# Altium schematic sheet Alimentation_USB_Header.SchDoc
size Tabloid; DocumentNumber: 3; SheetNumber: 3; SheetTotal: 7; Sheet_Name: Schéma_Bloc; Size: 11x17
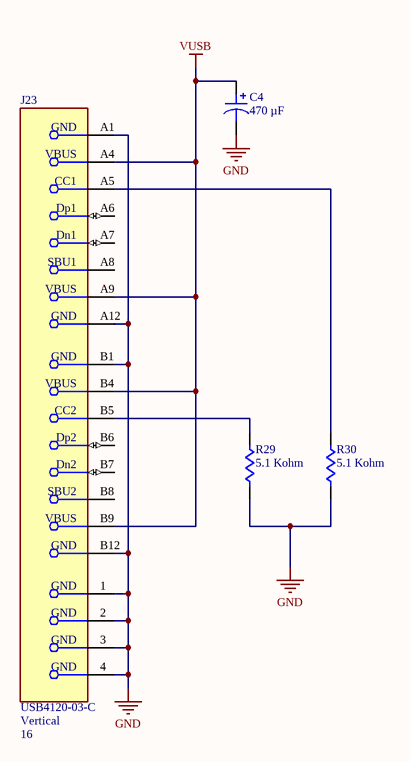
[diagram p0: Alimentation_USB_Header.SchDoc]

## Parts
C4  470 µF  [CAP TH ALPOLY D10.00mm S5.00mm H13.00mm]
J23  USB4120-03-C  Orientation: Vertical  Number of Pins: 16  [FP-USB4120-03-C-MFG]
R29  5.1 Kohm  [Res_Template]
R30  5.1 Kohm  [Res_Template]

## Nets
GND: C4.2 J23.1(GND) J23.2(GND) J23.3(GND) J23.4(GND) J23.A1(GND) J23.A12(GND) J23.B1(GND) J23.B12(GND) R29.1 R30.1
VUSB: C4.1 J23.A4(VBUS) J23.A9(VBUS) J23.B4(VBUS) J23.B9(VBUS)
NetJ23_A5: J23.A5(CC1) R30.2
NetJ23_B5: J23.B5(CC2) R29.2

Not connected (* = marked no-connect by the designer): J23 A6(Dp1) A7(Dn1) A8(SBU1) B6(Dp2) B7(Dn2) B8(SBU2)

## Notes on the sheet
- Nom de la feuille
- Titre du projet
- Cours associé au projet
- Taille
- Département
- Technologies du
- Révision
- PCB
- .
- SCH
- Date
- génie électrique
- Feuille
- Variant
- de
- Concepteurs

## Library data of the parts
C4 = A759MS477M1EAAE020: CAP ALUM POLY 470UF 20% 25V T/H; manufacturer: KEMET; ESR (Equivalent Series Resistance): 20mOhm; Lifetime @ Temp.: 2000 Hrs @ 125°C; Ripple Current @ High Frequency: 4.844 A @ 100 kHz; Ripple Current @ Low Frequency: 242.2 mA @ 120 Hz; Type: Polymer; Part Number: A759MS477M1EAAE020; Value: 470 µF; Applications: General Purpose; Capacitance: 470 µF; componentlink1description: Datasheet; componentlink1url: https://api.kemet.com/component-edge/download/specsheet/A759MS477M1EAAE020.pdf; componentlink2description: DigiKey Link; componentlink2url: https://www.digikey.com/en/products/detail/kemet/A759MS477M1EAAE020/13676499; Height - Seated (Max): 0.512" (13.00mm); lastupdated: 2024-06-03 20:25:49; Lead Spacing: 0.197" (5.00mm); Lifecycle Status: Active; Minimum Order: 1; Mounting Type: Through Hole; Operating Temperature: -55°C ~ 125°C; packaging: Bulk; partid: 4689; Part Status: Active; price: 0.24; series: A759; Size / Dimension: 0.394" Dia (10.00mm); Supplier 1: DigiKey; Supplier Part Number 1: 399-A759MS477M1EAAE020-ND; Tolerance: ±20%; Voltage - Rated: 25 V
J23 = CMP-03329-113696351-1: USB4120-03-C 16 Position 48 VDC USB Type C Vertical USB 2.0 Receptacle Connector; NexarPartId: 113696351
R29 R30 = 470 ohm: Custom Semiconductor Resistor